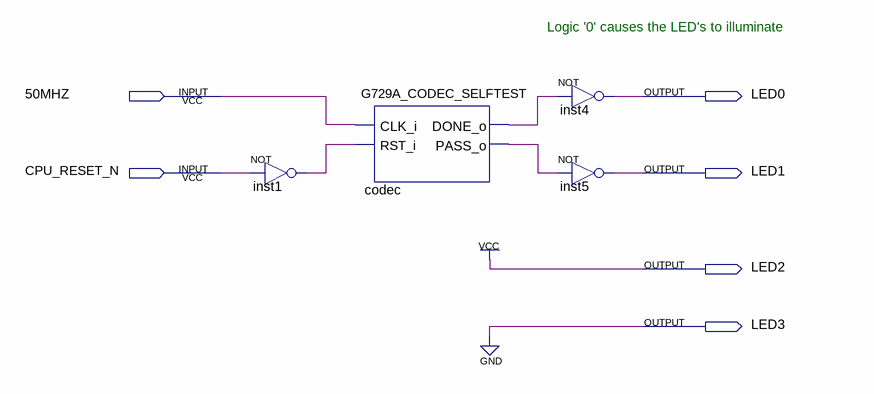
[diagram p0: schematic sheet]
// Quartus schematic g729a_syn.bdf as structural Verilog: 4 symbols, 6 pins
module g729a_syn (
  input  \50MHZ ,
  input  CPU_RESET_N,
  output LED0,
  output LED1,
  output LED2,
  output LED3
);

  wire codec_done_o, codec_pass_o, inst1_out;

  not inst1 (inst1_out, CPU_RESET_N);
  G729A_CODEC_SELFTEST codec (.CLK_i(\50MHZ ), .RST_i(inst1_out), .DONE_o(codec_done_o), .PASS_o(codec_pass_o));
  not inst4 (LED0, codec_done_o);
  not inst5 (LED1, codec_pass_o);

  assign LED2 = 1'b1;
  assign LED3 = 1'b0;

  // Notes on the sheet:
  //   Logic '0' causes the LED's to illuminate
endmodule
